# EAGLE design ArduSensor-Arcade (EAGLE 6.0)
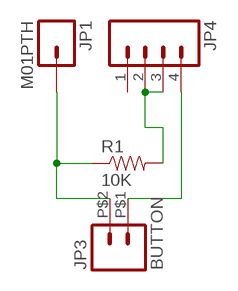
[diagram p0: schematic, sheet 1]

## Parts
JP1  M01PTH  [1X01]
JP3  BUTTON  M02PTH2  [1X02_BIG]
JP4  M04PTH  [1X04]
R1  10K  RESISTORAXIAL-0.3  [AXIAL-0.3]

## Nets
N$1: JP1.1 JP3.P$2 R1.P$1
N$2: JP4.2 JP4.3 R1.P$2
N$3: JP3.P$1 JP4.4
Unconnected: JP4.1

## Library data of the parts
JP1 = SFE Connectors:M01: Header 1 Standard 1-pin 0.1" header. Use with straight break away headers (SKU : PRT-00116), right angle break away headers (PRT-00553), swiss pins (PRT-00743), machine pins (PRT-00117), and female headers (PRT-00115).
JP3 = SFE Connectors:M02: Header 2 Standard 2-pin 0.1" header. Use with straight break away headers (SKU : PRT-00116), right angle break away headers (PRT-00553), swiss pins (PRT-00743), machine pins (PRT-00117), and female headers (PRT-00115). Molex polarized connector foot print use with SKU : PRT-08233 with associated crimp pins and housings.
JP4 = SFE Connectors:M04: Header 4 Standard 4-pin 0.1" header. Use with straight break away headers (SKU : PRT-00116), right angle break away headers (PRT-00553), swiss pins (PRT-00743), machine pins (PRT-00117), and female headers (PRT-00115). Molex polarized connector foot print use with SKU : PRT-08231 with associated crimp pins and housings. 1MM SMD Version SKU: PRT-10208
R1 = SFE Passives:RESISTOR: Resistor Basic schematic elements and footprints for 0603, 1206, and PTH resistors.

## Board
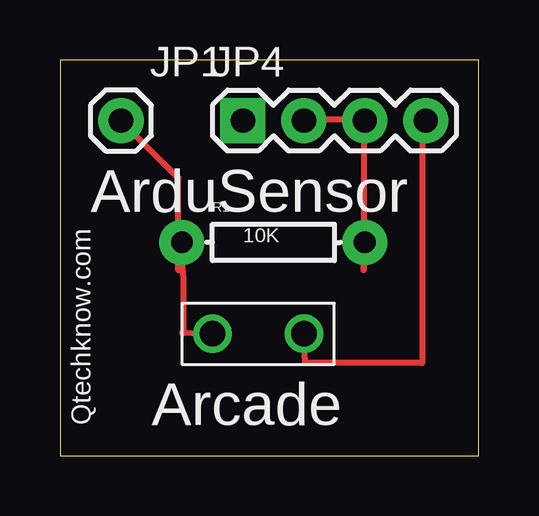
[diagram p1: board, top side]
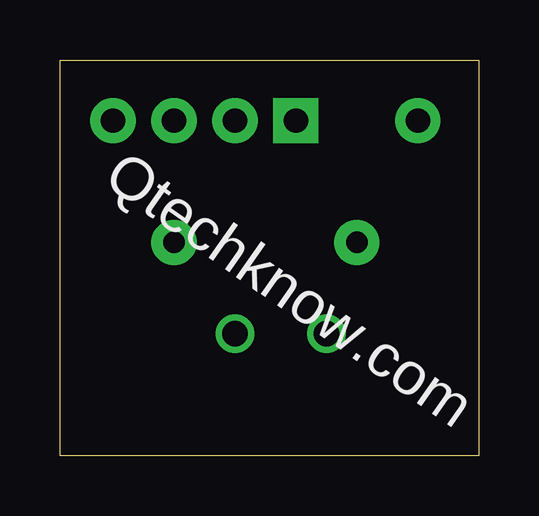
[diagram p2: board, bottom side, seen from below]

Size 17.45 x 16.5 mm. Coordinates in mm from the lower left corner, seen from the top.
Outline: 0,0 17.45,0 17.45,16.5 0,16.5 0,0
Copper layers (1*16): Top 0.035mm / dielectric 1.5mm / Bottom 0.035mm
Design rules: minimum track width 10mil, minimum drill 24mil, track to track 8mil, track to pad 8mil, pad to pad 8mil, via to via 8mil, smd to smd 8mil, copper to edge 40mil, drill to drill 8mil, minimum pad ring 10mil, minimum via ring 8mil, stop-mask expansion 4mil, vias tented up to drill 0mil, thermal gap 10mil

### Footprints (pad centres in the part's own frame; a part is rotated, then mirrored left to right if it is on the bottom)
1X01 = drill 1.016 pad 1.88: 1 0,0
1X02_BIG = drill 1.067: P$1 0,0; P$2 3.81,0
1X04 = drill 1.016 pad 1.88 square: 1 0,0 | drill 1.016 pad 1.88: 2 2.54,0; 3 5.08,0; 4 7.62,0
AXIAL-0.3 = drill 0.9 pad 1.88: P$1 -3.81,0; P$2 3.81,0

### Placement (x,y rotation side)
JP1  2.54,13.97 0 top
JP3  [1X02_BIG]  10.16,5.08 180 top
JP4  7.62,13.97 0 top
R1  [AXIAL-0.3]  8.89,8.89 0 top

### Tracks (layer width: path | path; a pad name or v marks a point on that pad's centre or on a via)
N$1
  Top 0.254: JP3.P$2 5.08,5.13 5.13,5.08 5.13,7.52 R1.P$1 4.93,7.72 4.93,11.58 JP1.1
N$2
  Top 0.254: JP4.2 10.21,14.02 12.65,14.02 JP4.3 12.65,13.82 12.65,7.72 R1.P$2
N$3
  Top 0.254: JP3.P$1 10.21,3.86 15.09,3.86 15.09,13.82 JP4.4

### Text on the board
tPlace: ArduSensor | 10K | Qtechknow.com | Arcade
bPlace: Qtechknow.com